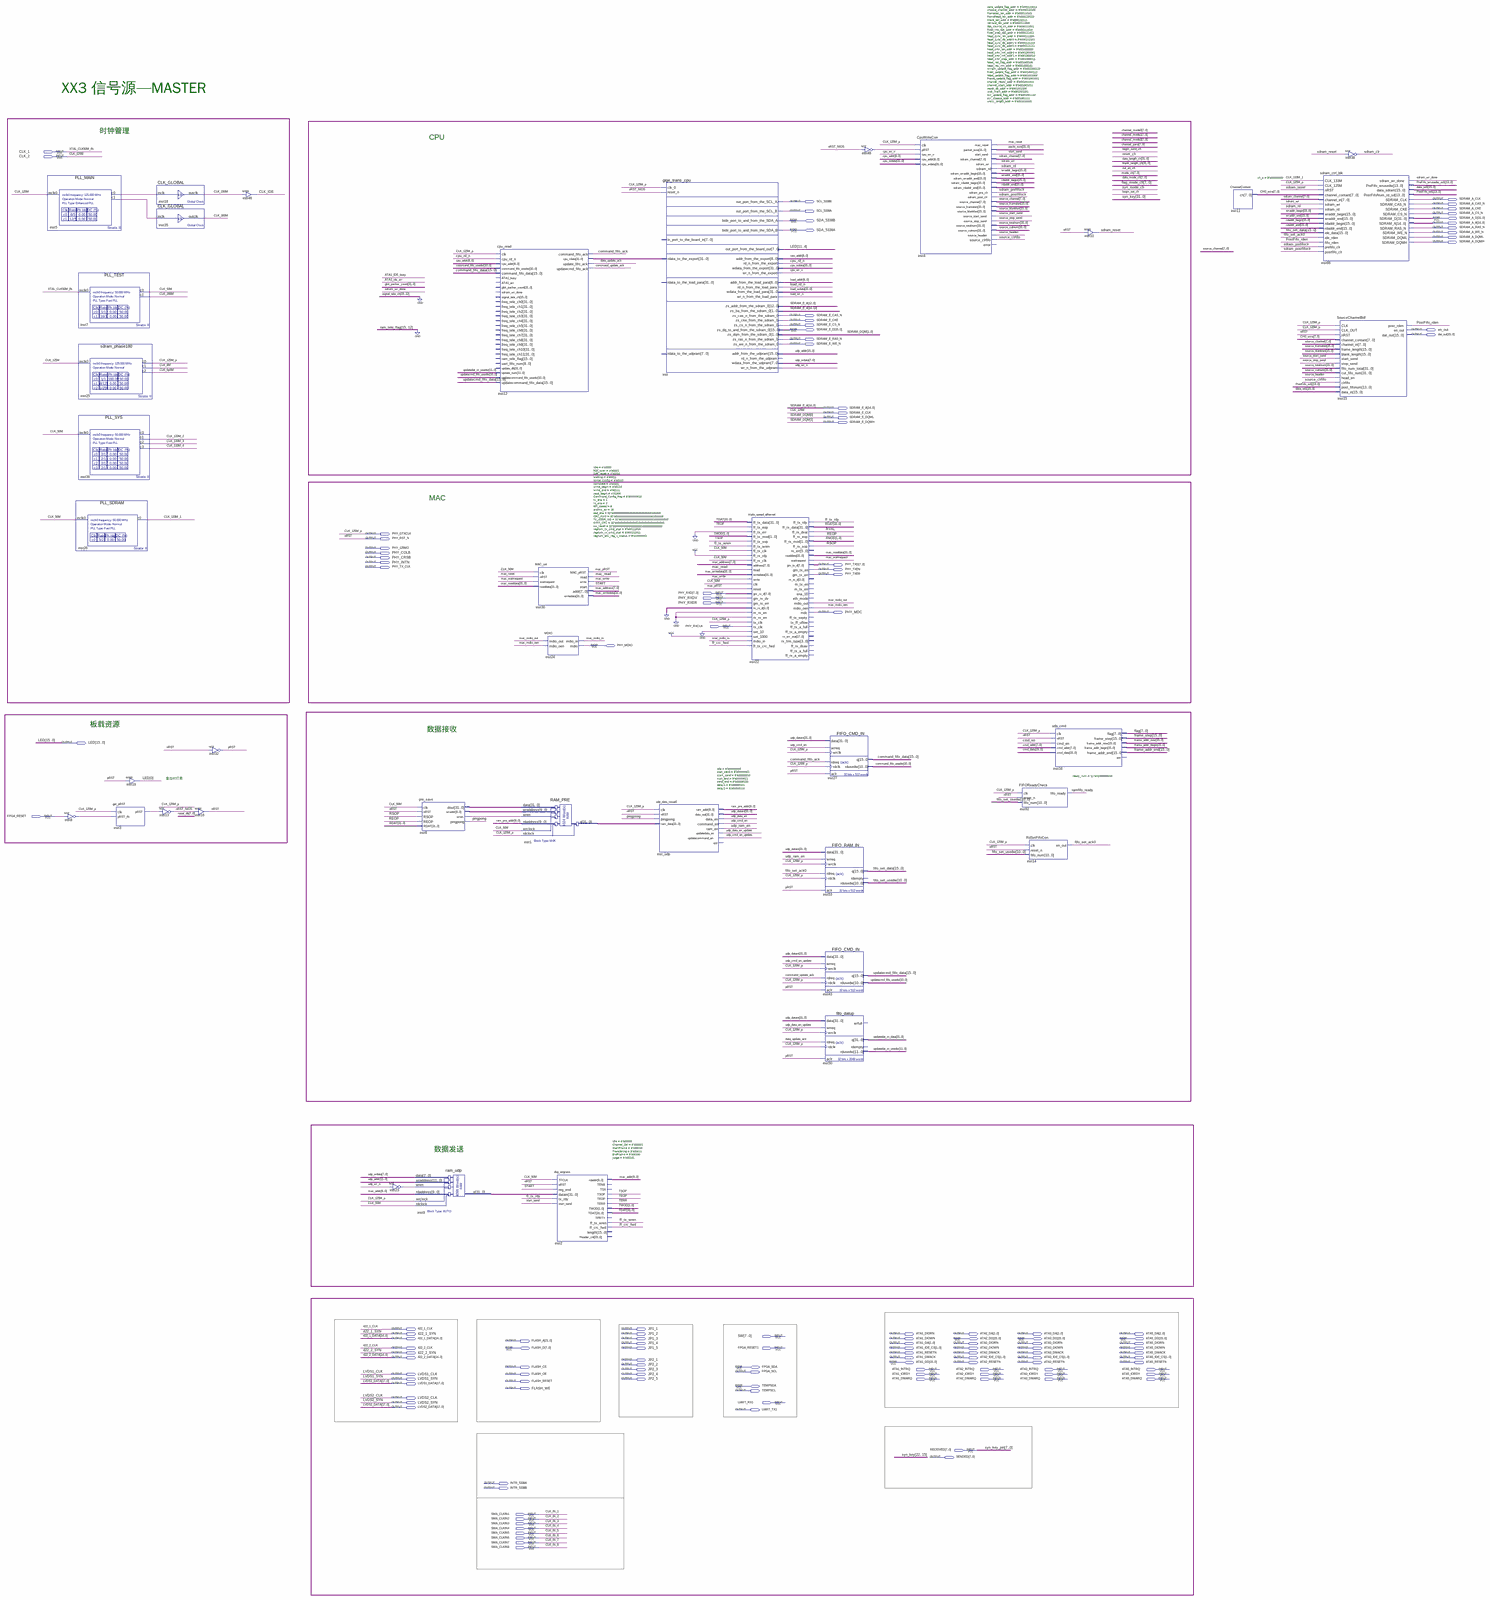
[diagram p0: schematic sheet, whole]
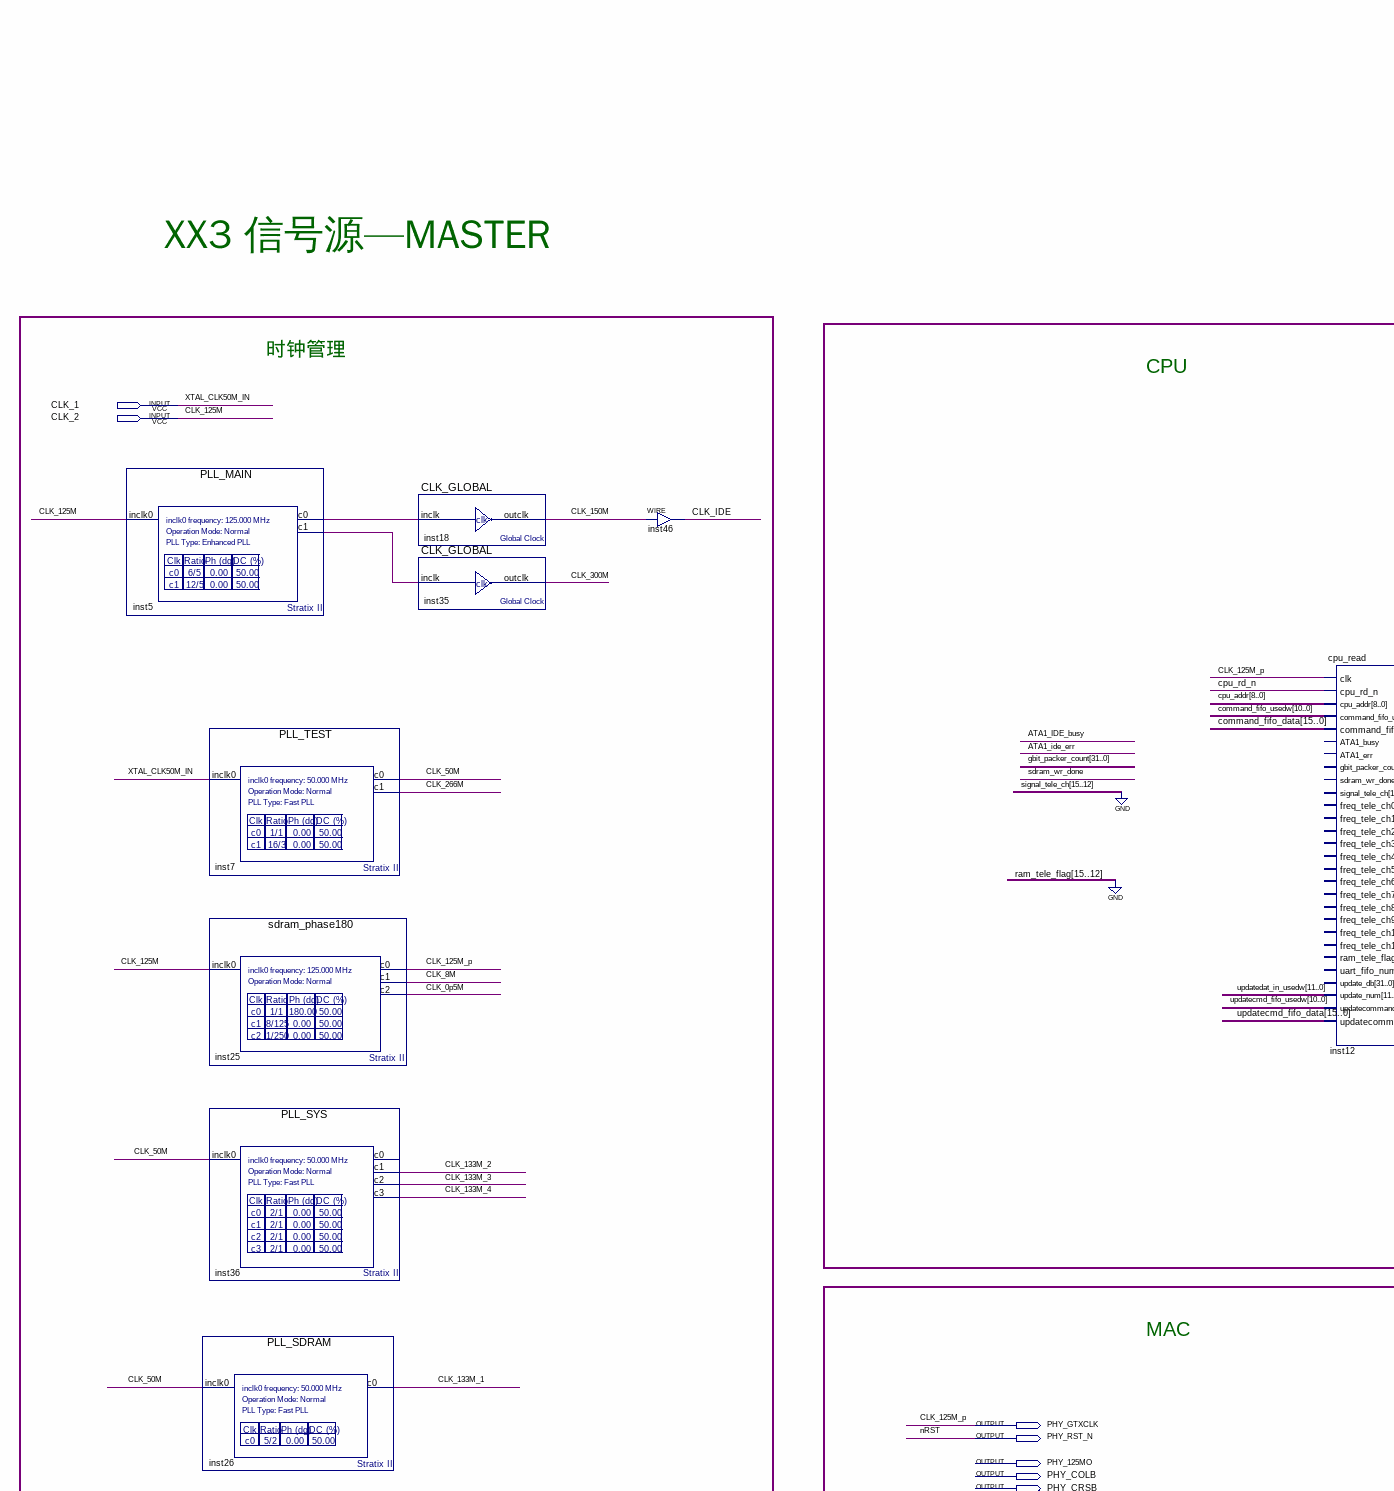
[diagram p1: schematic sheet, upper left part]
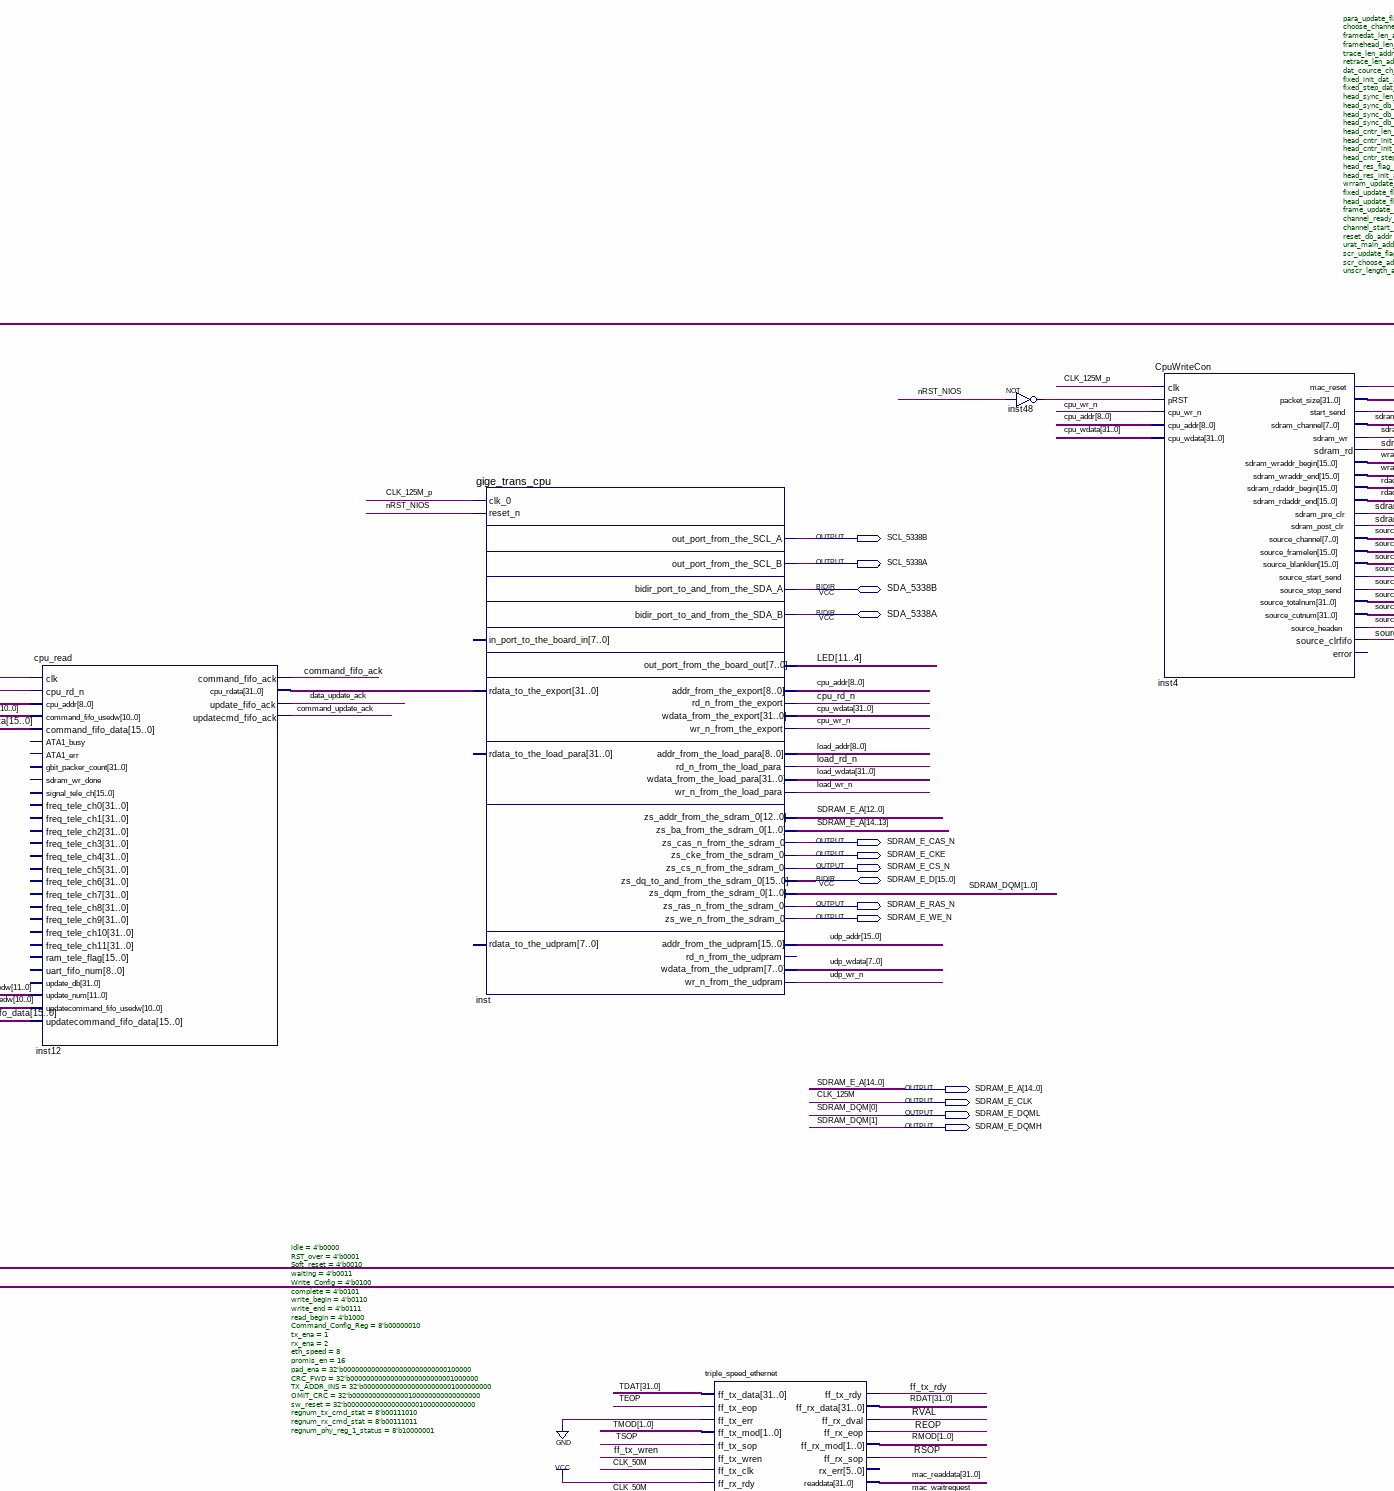
[diagram p2: schematic sheet, upper centre part]
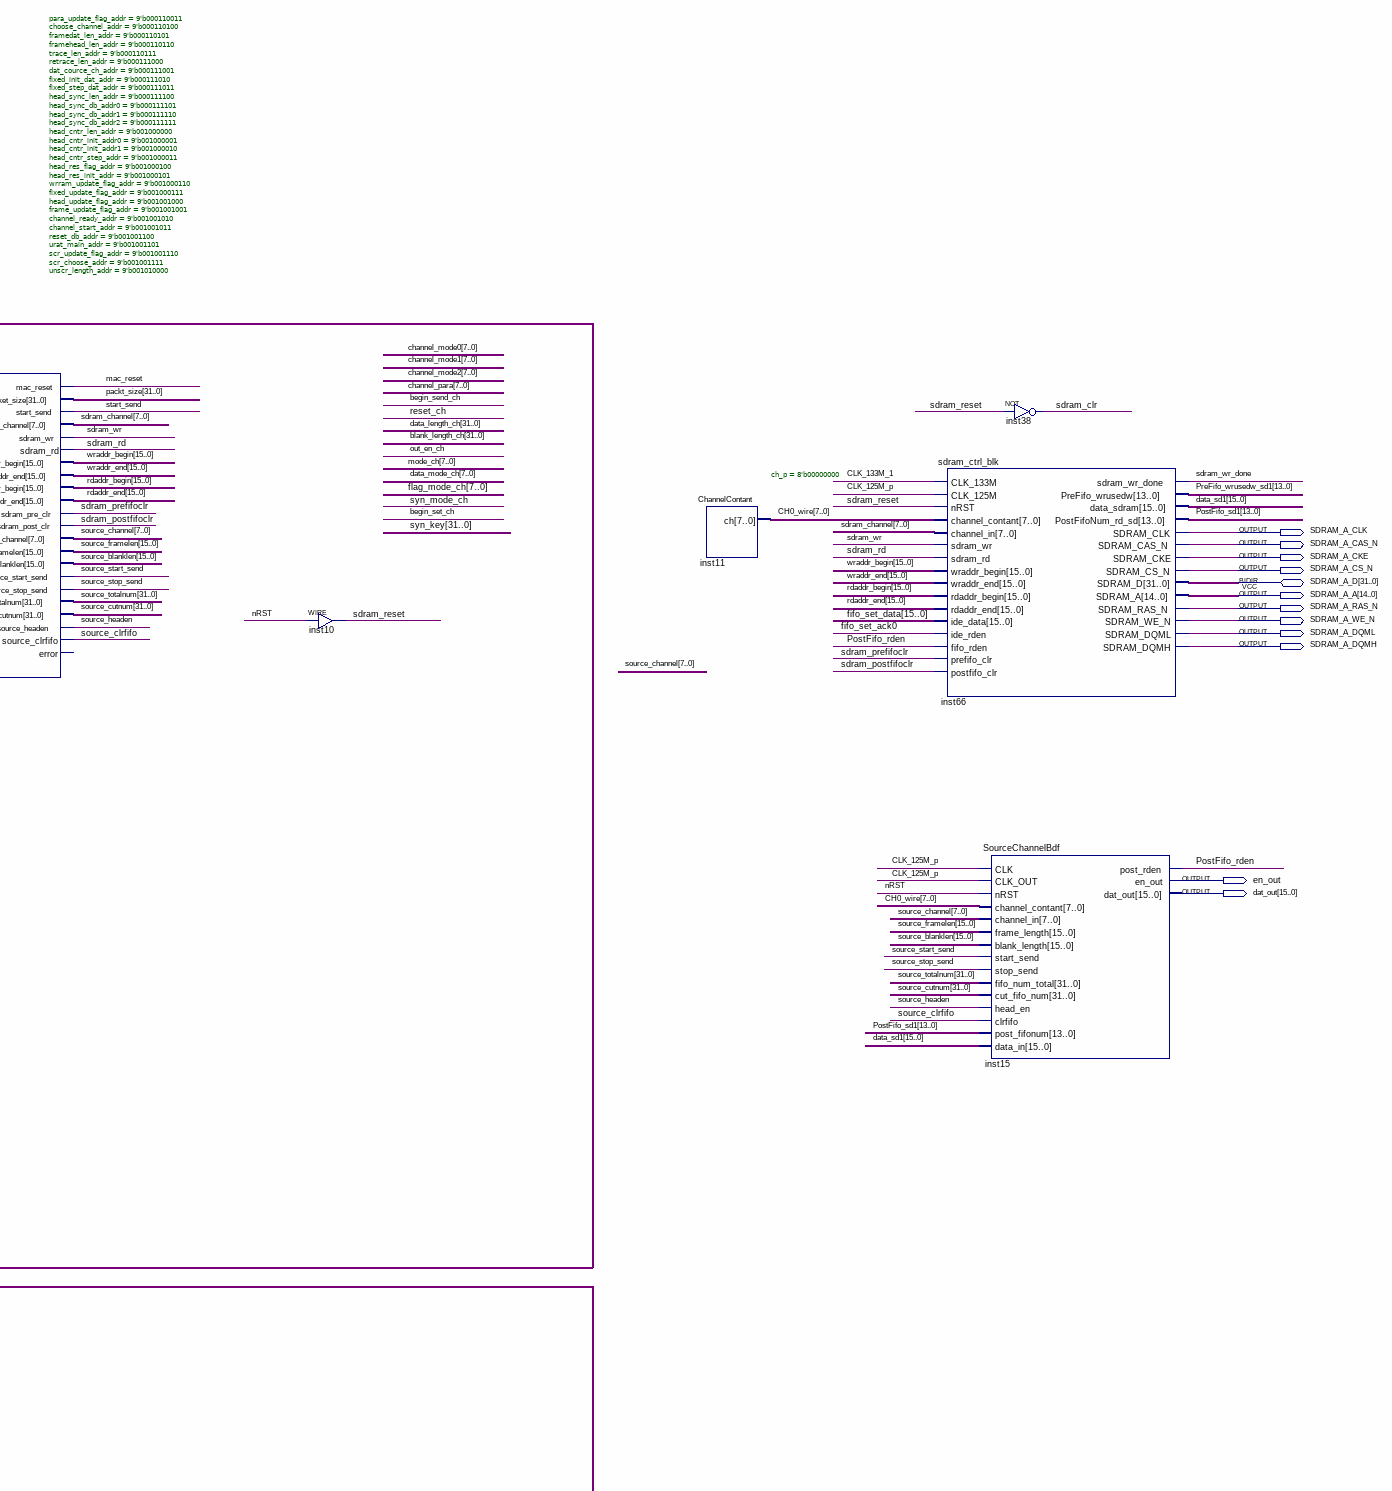
[diagram p3: schematic sheet, upper right part]
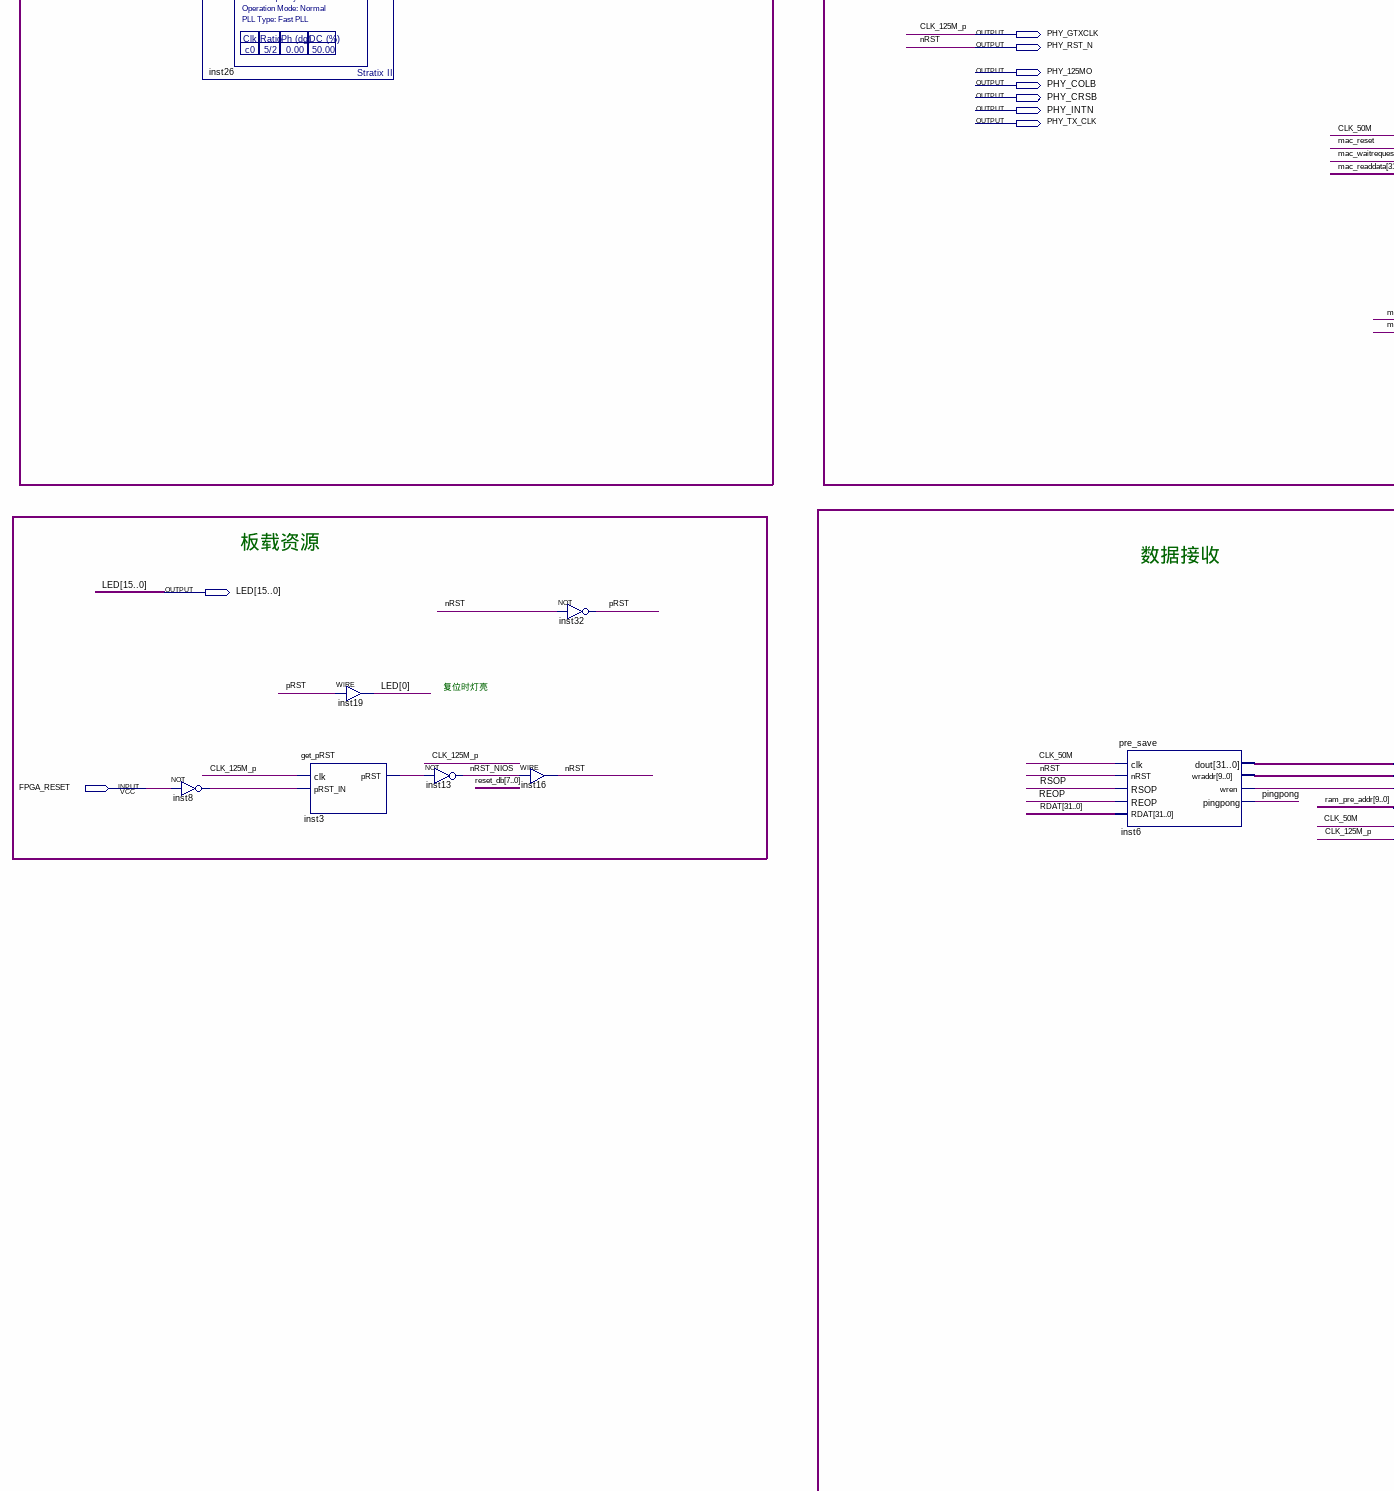
[diagram p4: schematic sheet, middle left part]
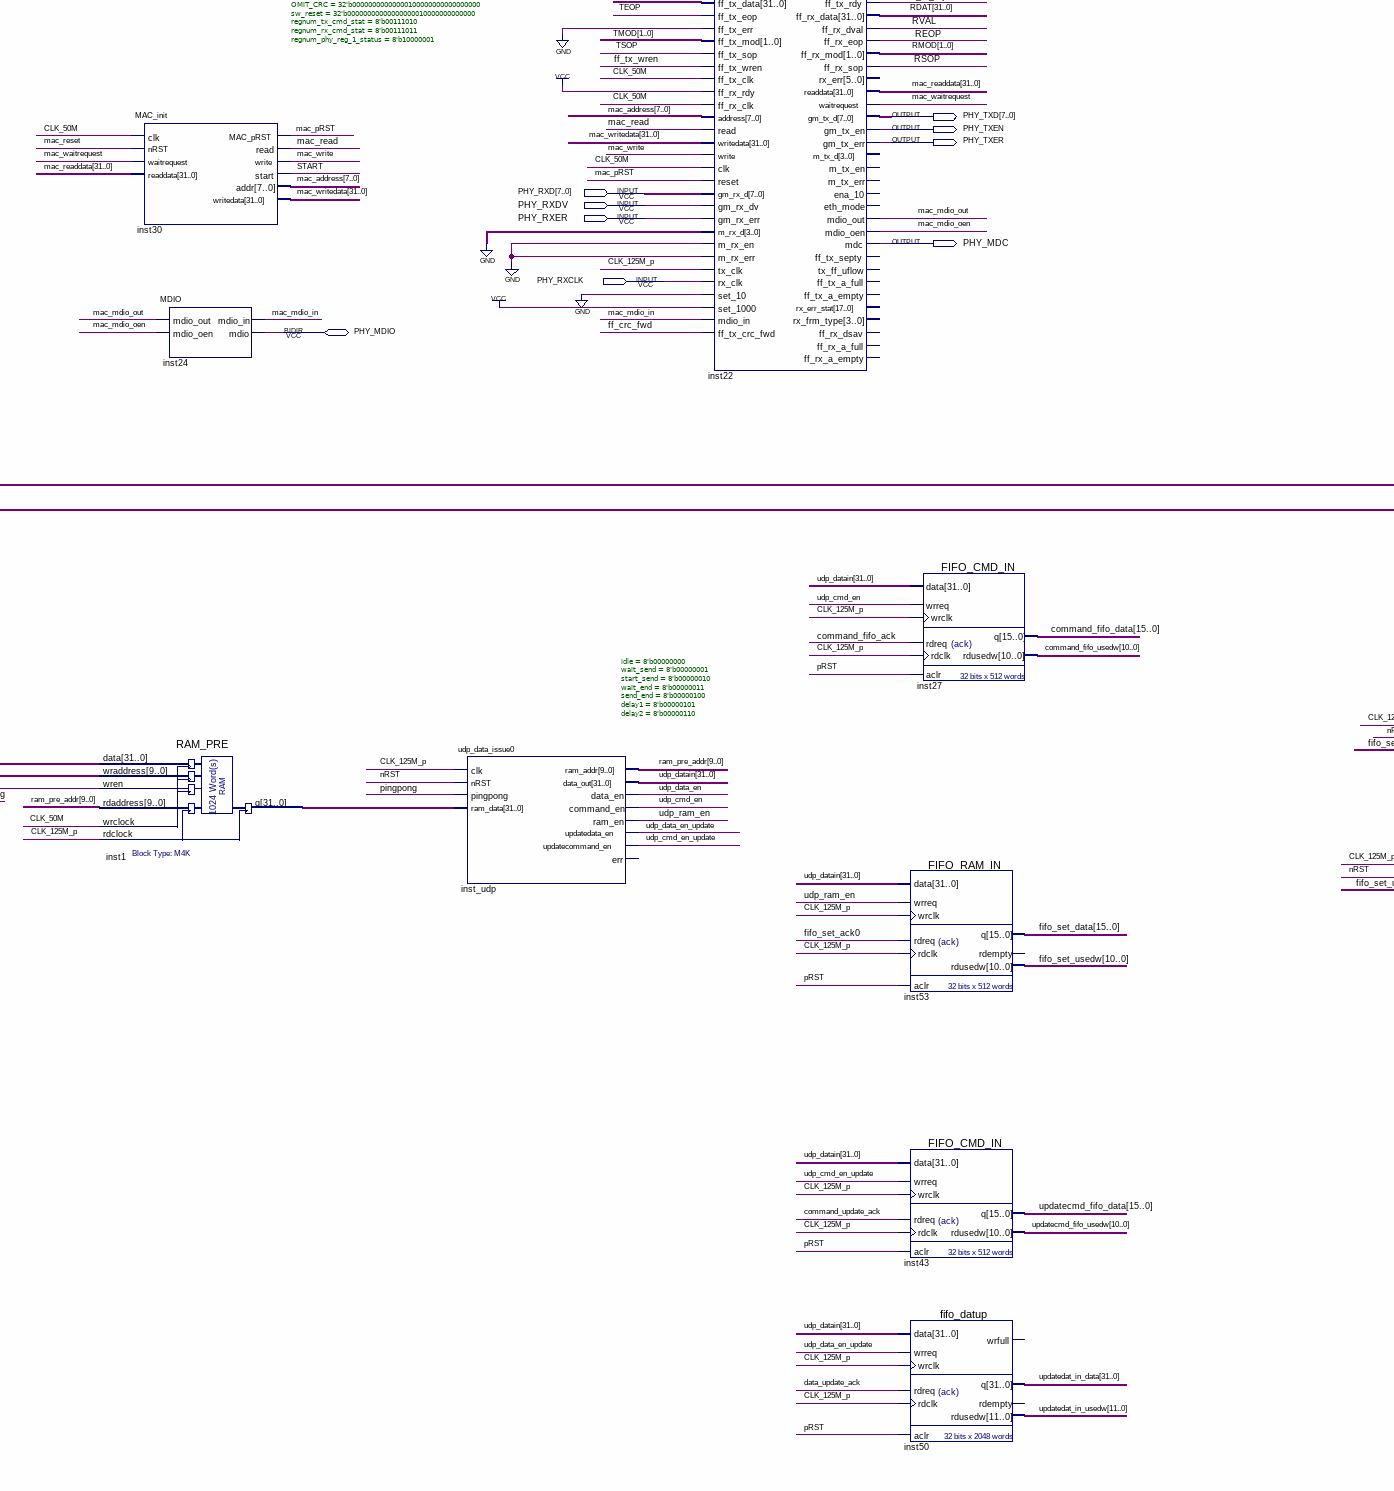
[diagram p5: schematic sheet, middle centre part]
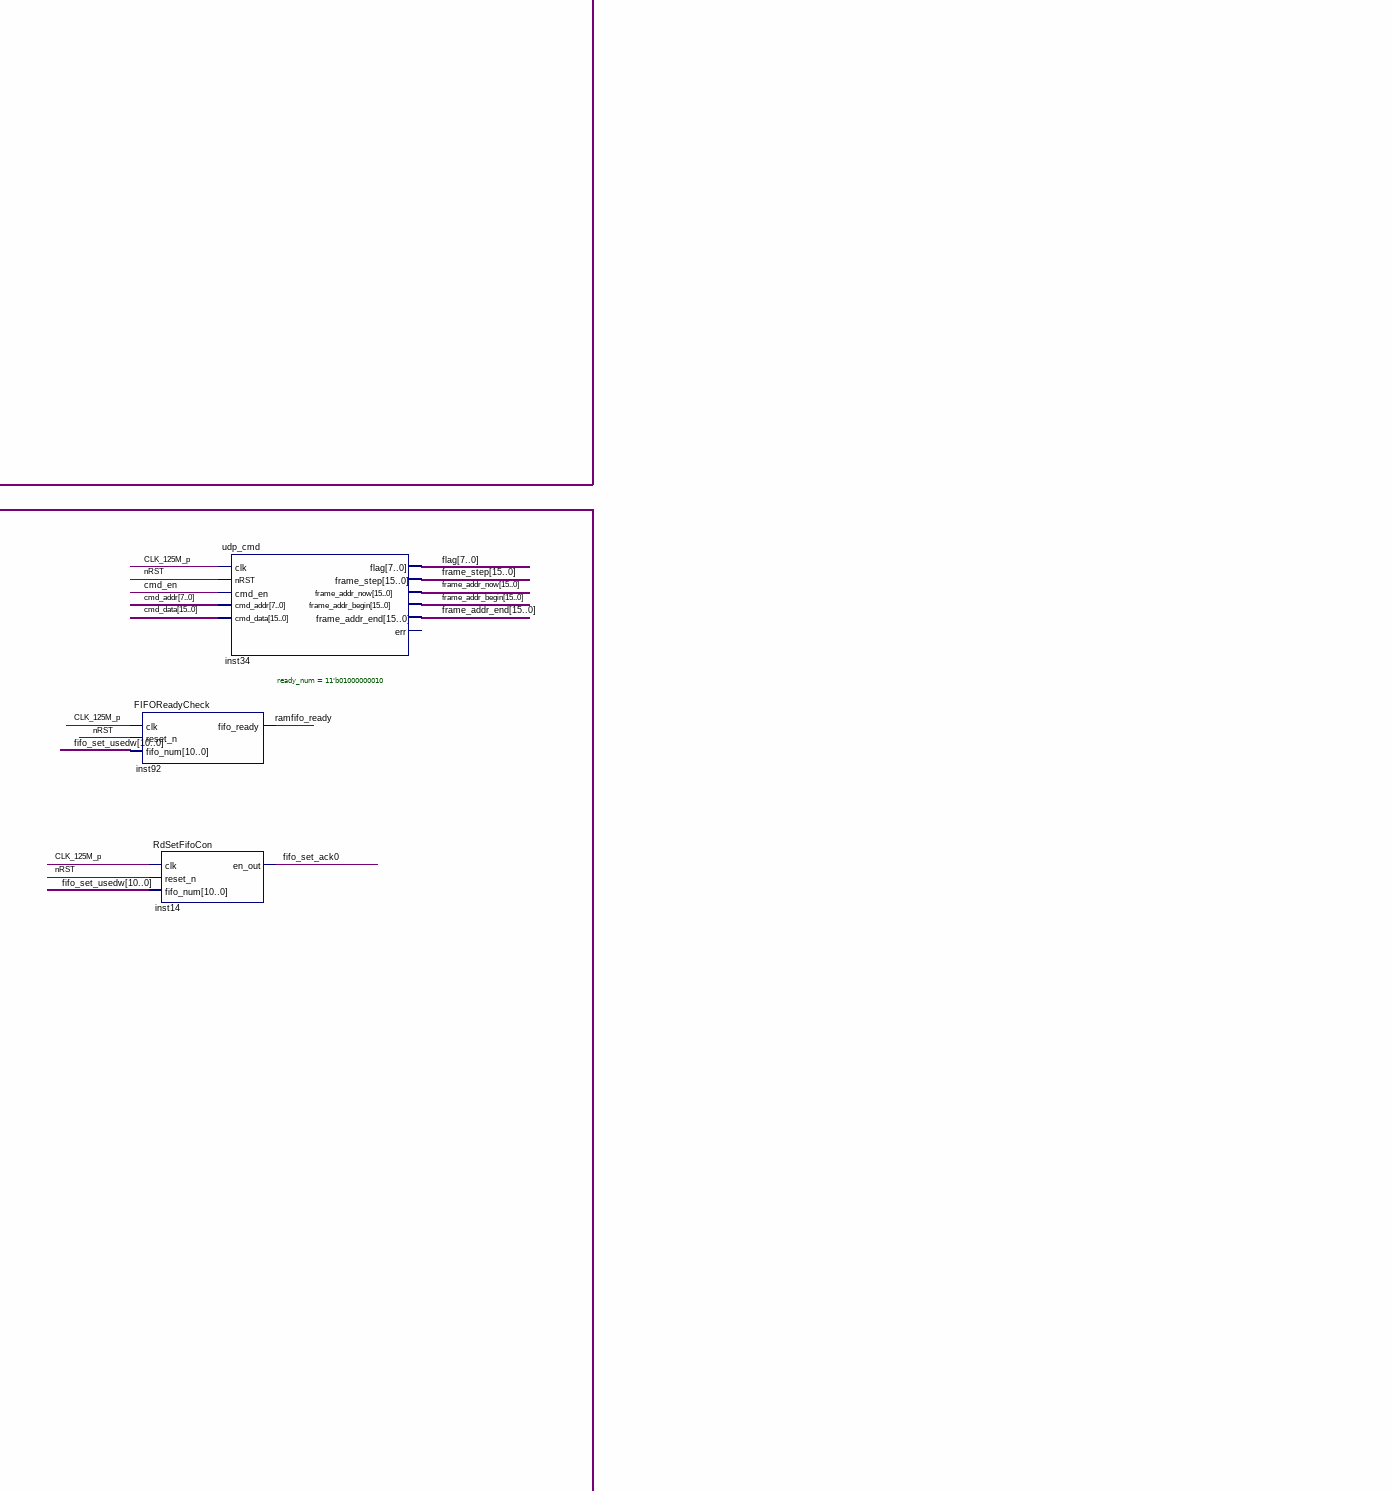
[diagram p6: schematic sheet, middle right part]
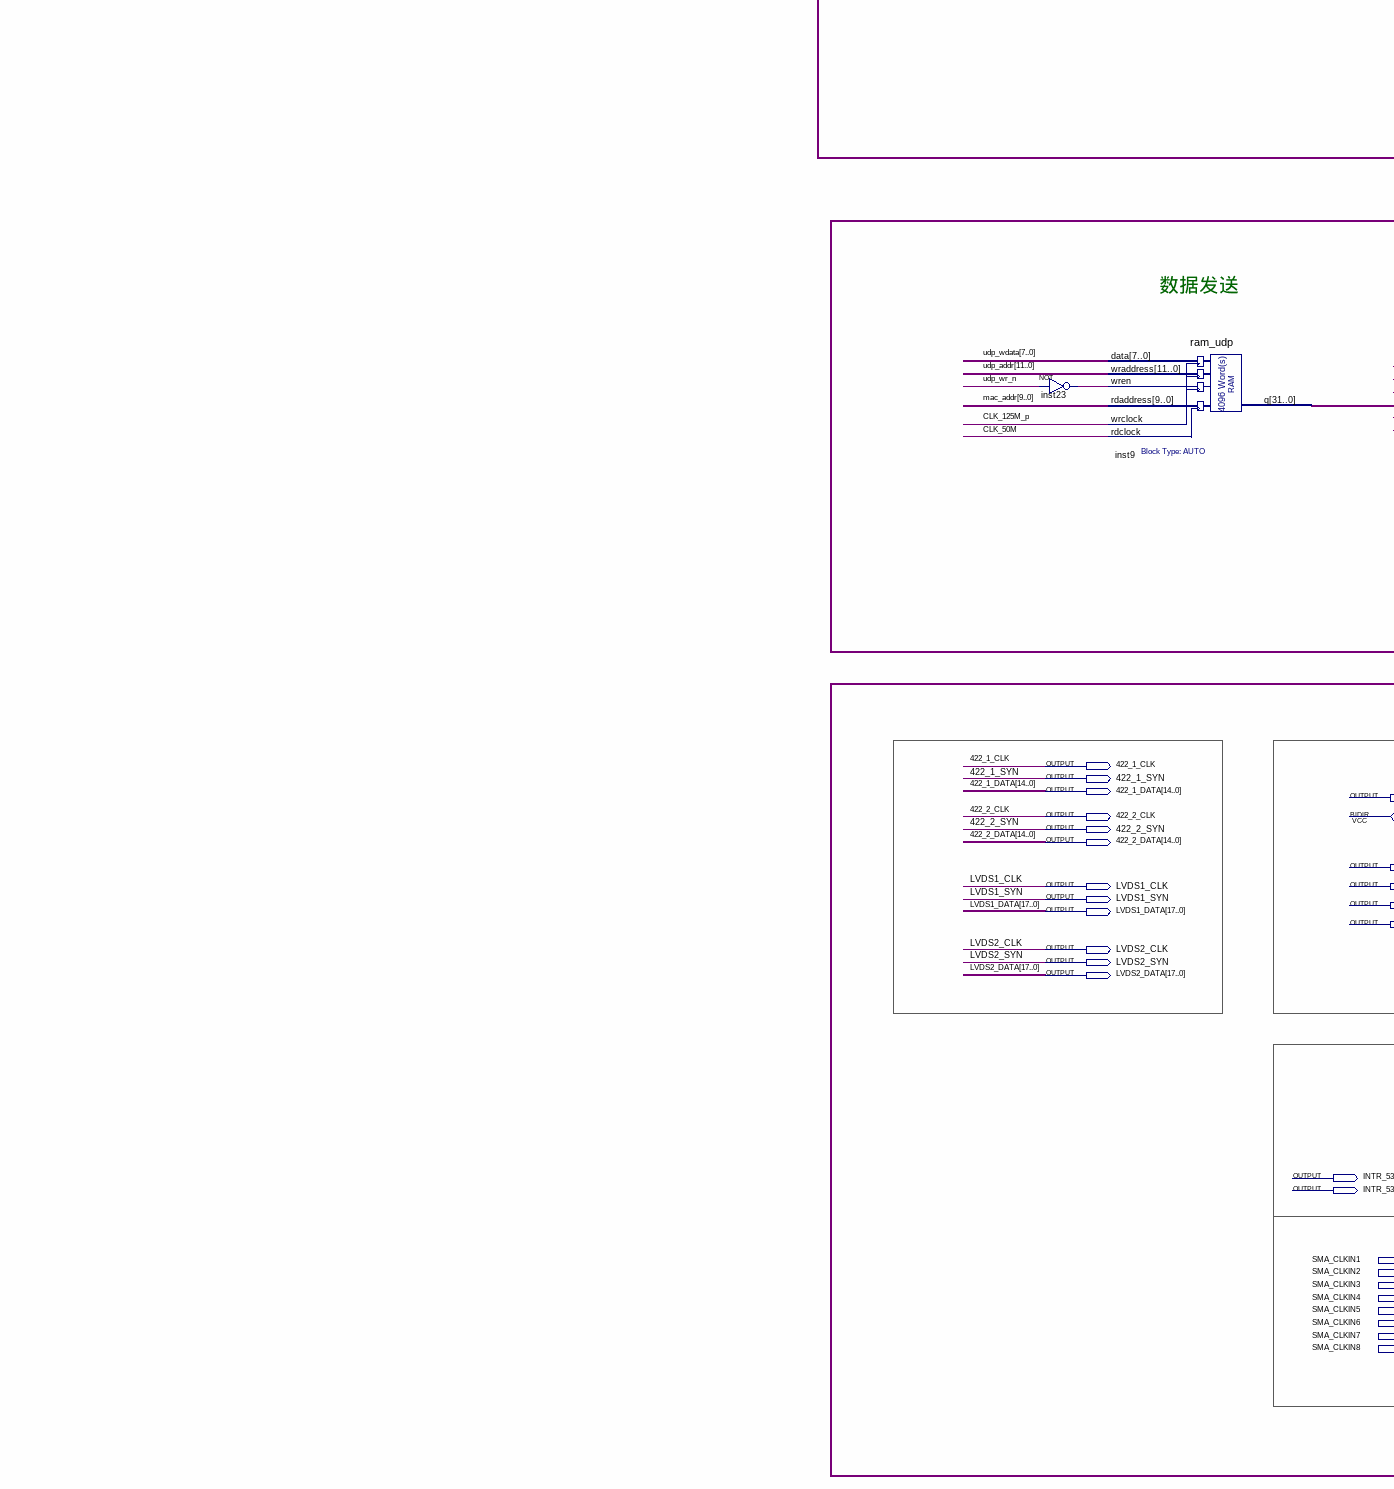
[diagram p7: schematic sheet, lower left part]
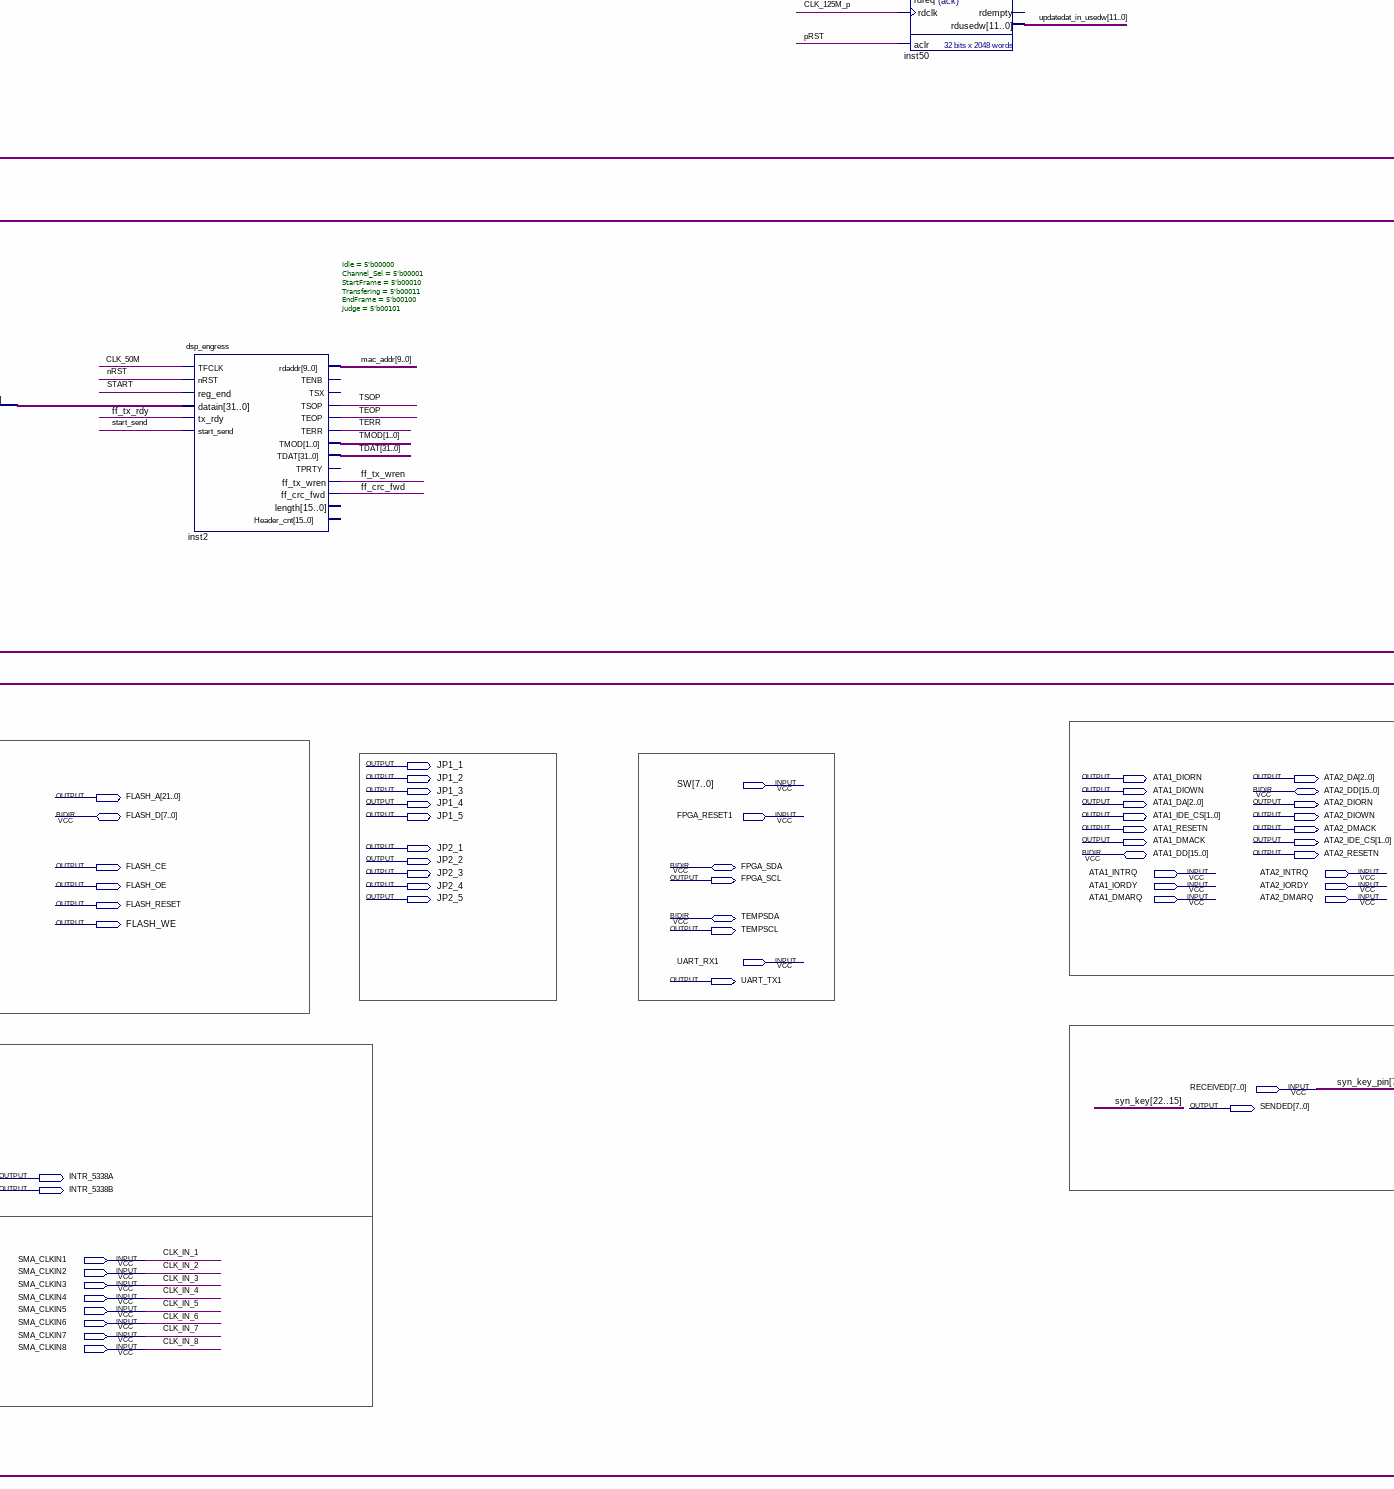
[diagram p8: schematic sheet, lower centre part]
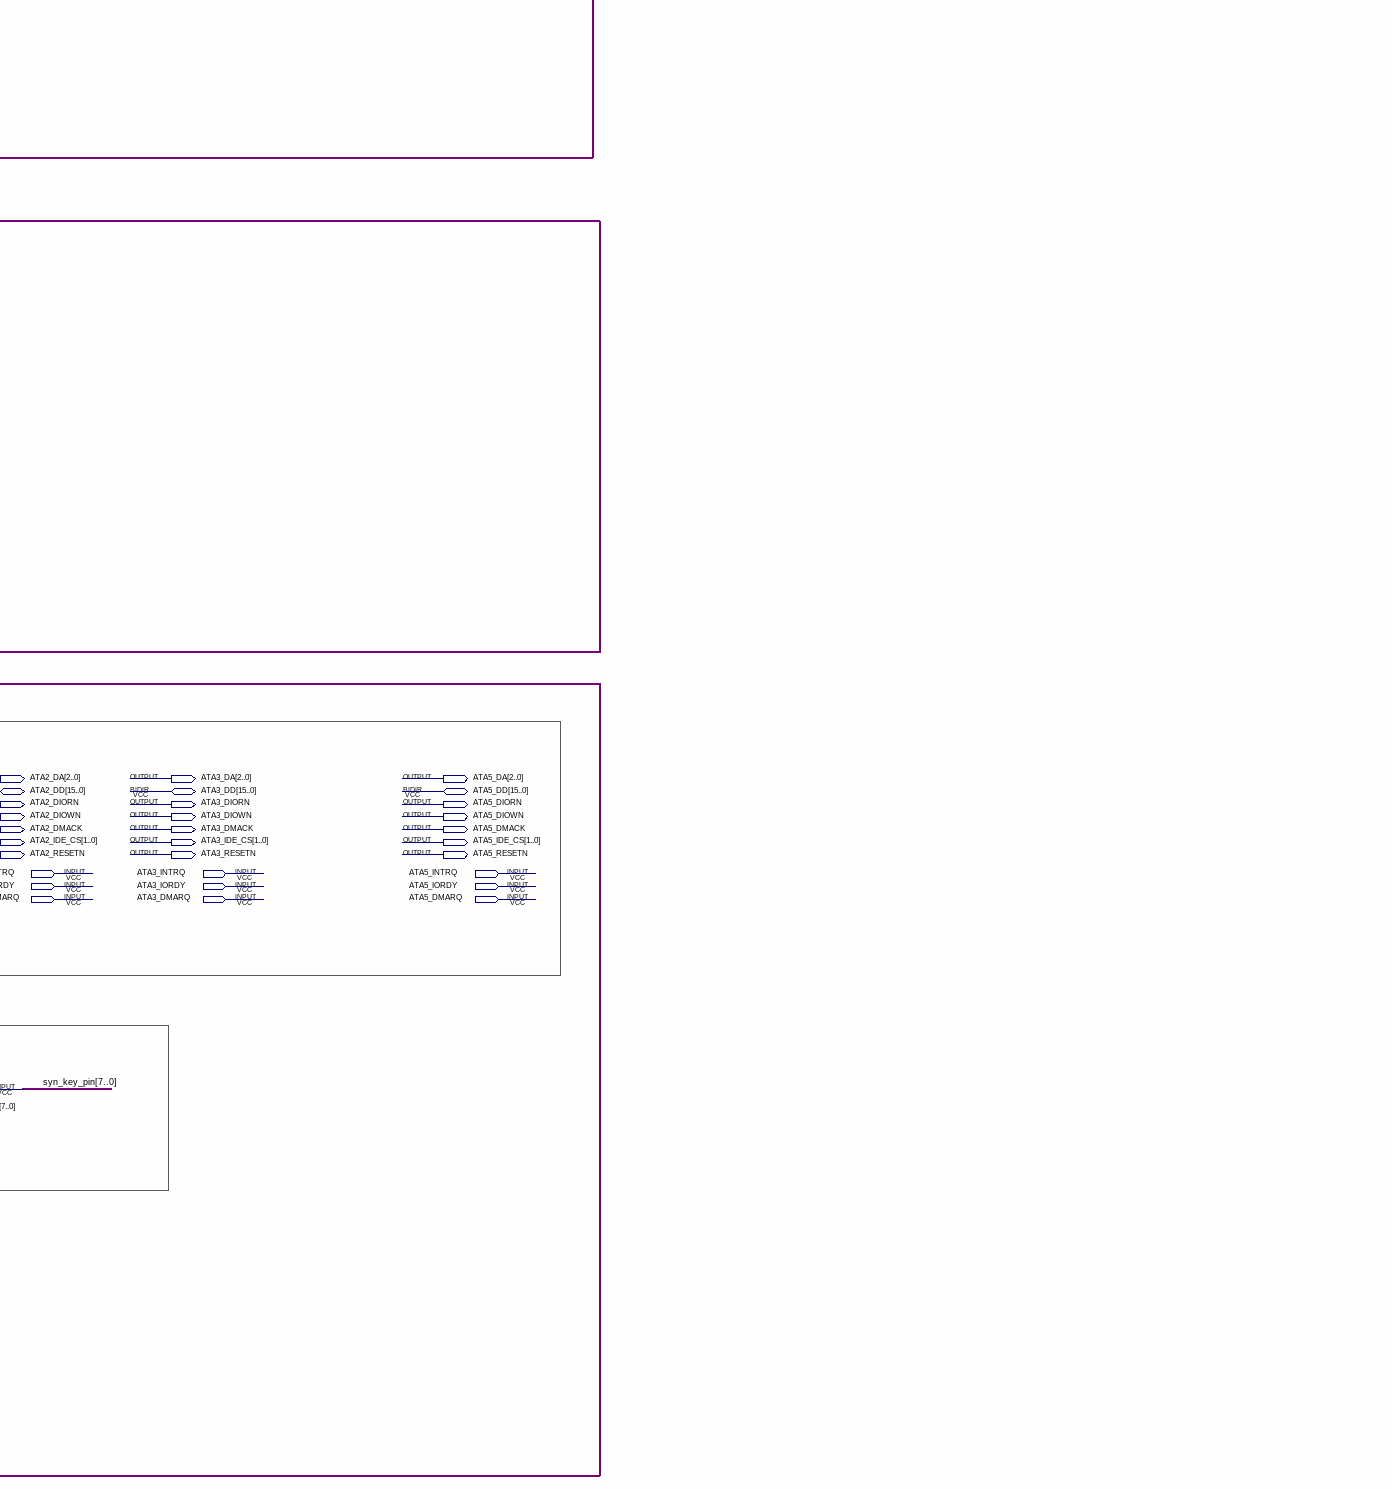
[diagram p9: schematic sheet, lower right part]
// Quartus schematic gige_transport_top.bdf as structural Verilog: 39 symbols, 134 pins
module gige_transport_top (
  input  CLK_1,
  input  CLK_2,
  input  [7:0] PHY_RXD,
  input  PHY_RXDV,
  input  PHY_RXER,
  input  PHY_RXCLK,
  input  FPGA_RESET,
  input  [7:0] SW,
  input  FPGA_RESET1,
  input  ATA1_INTRQ,
  input  ATA2_INTRQ,
  input  ATA3_INTRQ,
  input  ATA5_INTRQ,
  input  ATA1_IORDY,
  input  ATA2_IORDY,
  input  ATA3_IORDY,
  input  ATA5_IORDY,
  input  ATA1_DMARQ,
  input  ATA2_DMARQ,
  input  ATA3_DMARQ,
  input  ATA5_DMARQ,
  input  UART_RX1,
  input  [7:0] RECEIVED,
  input  SMA_CLKIN1,
  input  SMA_CLKIN2,
  input  SMA_CLKIN3,
  input  SMA_CLKIN4,
  input  SMA_CLKIN5,
  input  SMA_CLKIN6,
  input  SMA_CLKIN7,
  input  SMA_CLKIN8,
  inout  [31:0] SDRAM_A_D,
  inout  SDA_5338B,
  inout  SDA_5338A,
  inout  [15:0] SDRAM_E_D,
  inout  PHY_MDIO,
  inout  [15:0] ATA2_DD,
  inout  [15:0] ATA3_DD,
  inout  [15:0] ATA5_DD,
  inout  [7:0] FLASH_D,
  inout  [15:0] ATA1_DD,
  inout  FPGA_SDA,
  inout  TEMPSDA,
  output SDRAM_A_CLK,
  output SCL_5338B,
  output SDRAM_A_CAS_N,
  output SDRAM_A_CKE,
  output SCL_5338A,
  output SDRAM_A_CS_N,
  output [14:0] SDRAM_A_A,
  output SDRAM_A_RAS_N,
  output SDRAM_A_WE_N,
  output SDRAM_A_DQML,
  output SDRAM_A_DQMH,
  output SDRAM_E_CAS_N,
  output SDRAM_E_CKE,
  output SDRAM_E_CS_N,
  output en_out,
  output [15:0] dat_out,
  output SDRAM_E_RAS_N,
  output SDRAM_E_WE_N,
  output [14:0] SDRAM_E_A,
  output SDRAM_E_CLK,
  output SDRAM_E_DQML,
  output SDRAM_E_DQMH,
  output PHY_GTXCLK,
  output PHY_RST_N,
  output PHY_125MO,
  output PHY_COLB,
  output PHY_CRSB,
  output PHY_INTN,
  output [7:0] PHY_TXD,
  output PHY_TX_CLK,
  output PHY_TXEN,
  output PHY_TXER,
  output PHY_MDC,
  output [15:0] LED,
  output \422_1_CLK ,
  output JP1_1,
  output \422_1_SYN ,
  output JP1_2,
  output ATA1_DIORN,
  output [2:0] ATA2_DA,
  output [2:0] ATA3_DA,
  output [2:0] ATA5_DA,
  output [14:0] \422_1_DATA ,
  output JP1_3,
  output ATA1_DIOWN,
  output [21:0] FLASH_A,
  output JP1_4,
  output [2:0] ATA1_DA,
  output ATA2_DIORN,
  output ATA3_DIORN,
  output ATA5_DIORN,
  output \422_2_CLK ,
  output JP1_5,
  output [1:0] ATA1_IDE_CS,
  output ATA2_DIOWN,
  output ATA3_DIOWN,
  output ATA5_DIOWN,
  output \422_2_SYN ,
  output ATA1_RESETN,
  output ATA2_DMACK,
  output ATA3_DMACK,
  output ATA5_DMACK,
  output [14:0] \422_2_DATA ,
  output ATA1_DMACK,
  output [1:0] ATA2_IDE_CS,
  output [1:0] ATA3_IDE_CS,
  output [1:0] ATA5_IDE_CS,
  output JP2_1,
  output ATA2_RESETN,
  output ATA3_RESETN,
  output ATA5_RESETN,
  output JP2_2,
  output FLASH_CE,
  output JP2_3,
  output FPGA_SCL,
  output LVDS1_CLK,
  output FLASH_OE,
  output JP2_4,
  output LVDS1_SYN,
  output JP2_5,
  output FLASH_RESET,
  output [17:0] LVDS1_DATA,
  output FLASH_WE,
  output TEMPSCL,
  output LVDS2_CLK,
  output LVDS2_SYN,
  output [17:0] LVDS2_DATA,
  output UART_TX1,
  output [7:0] SENDED,
  output INTR_5338A,
  output INTR_5338B
);

  wire CLK_0p5M, CLK_8M, CLK_50M, CLK_133M_1, CLK_133M_2, CLK_133M_3, CLK_133M_4, CLK_150M, CLK_266M,
       CLK_300M, CLK_IDE, cmd_en, command_fifo_ack, command_update_ack, cpu_rd_n, cpu_wr_n, data_update_ack,
       ff_crc_fwd, ff_tx_rdy, ff_tx_wren, fifo_set_ack0, inst3_prst, inst5_c0, inst5_c1, inst6_wren,
       inst8_out, inst23_out, inst48_out, load_rd_n, load_wr_n, mac_mdio_in, mac_mdio_oen, mac_mdio_out,
       mac_pRST, mac_read, mac_reset, mac_waitrequest, mac_write, nRST_NIOS, pingpong, PostFifo_rden, pRST,
       ramfifo_ready, REOP, RSOP, RVAL, sdram_clr, sdram_postfifoclr, sdram_prefifoclr, sdram_rd,
       sdram_reset, sdram_wr, sdram_wr_done, source_clrfifo, source_headen, source_start_send,
       source_stop_send, START, start_send, TEOP, TERR, TSOP, udp_cmd_en, udp_cmd_en_update, udp_data_en,
       udp_data_en_update, udp_ram_en, udp_wr_n;
  wire [1:0] RMOD, TMOD;
  wire [7:0] CH0_wire, cmd_addr, flag, mac_address, sdram_channel, source_channel, udp_wdata;
  wire [8:0] cpu_addr, load_addr;
  wire [9:0] inst6_wraddr, mac_addr, ram_pre_addr;
  wire [10:0] command_fifo_usedw, fifo_set_usedw, updatecmd_fifo_usedw;
  wire [11:0] updatedat_in_usedw;
  wire [13:0] PostFifo_sd1, PreFifo_wrusedw_sd1;
  wire [15:0] cmd_data, command_fifo_data, data_sd1, fifo_set_data, frame_addr_begin, frame_addr_end,
       frame_addr_now, frame_step, rdaddr_begin, rdaddr_end, source_blanklen, source_framelen, udp_addr,
       updatecmd_fifo_data, wraddr_begin, wraddr_end;
  wire [31:0] cpu_wdata, inst1_q, inst6_dout, inst9_q, inst12_cpu_rdata, load_wdata, mac_readdata,
       mac_writedata, packt_size, RDAT, source_cutnum, source_totalnum, TDAT, udp_datain, updatedat_in_data;

  PLL_MAIN inst5 (.inclk0(CLK_2), .c0(inst5_c0), .c1(inst5_c1));
  not inst8 (inst8_out, FPGA_RESET);
  PLL_TEST inst7 (.inclk0(CLK_1), .c0(CLK_50M), .c1(CLK_266M));
  sdram_phase180 inst25 (.inclk0(CLK_2), .c0(PHY_GTXCLK), .c1(CLK_8M), .c2(CLK_0p5M));
  PLL_SYS inst36 (.inclk0(CLK_50M), .c1(CLK_133M_2), .c2(CLK_133M_3), .c3(CLK_133M_4));  // open: c0
  PLL_SDRAM inst26 (.inclk0(CLK_50M), .c0(CLK_133M_1));
  get_pRST inst3 (.clk(PHY_GTXCLK), .pRST_IN(inst8_out), .pRST(inst3_prst));
  assign LED[0] = pRST;  // WIRE inst19
  CLK_GLOBAL inst18 (.inclk(inst5_c0), .outclk(CLK_150M));
  CLK_GLOBAL inst35 (.inclk(inst5_c1), .outclk(CLK_300M));
  not inst13 (nRST_NIOS, inst3_prst);
  assign PHY_RST_N = nRST_NIOS;  // WIRE inst16
  not inst32 (pRST, PHY_RST_N);
  assign CLK_IDE = CLK_150M;  // WIRE inst46
  not inst23 (inst23_out, udp_wr_n);
  pre_save inst6 (
    .clk(CLK_50M), .nRST(PHY_RST_N), .RSOP(RSOP), .REOP(REOP), .RDAT(RDAT), .dout(inst6_dout),
    .wraddr(inst6_wraddr), .wren(inst6_wren), .pingpong(pingpong));
  ram_udp inst9 (
    .data(udp_wdata), .wraddress(udp_addr[11:0]), .wren(inst23_out), .rdaddress(mac_addr),
    .wrclock(PHY_GTXCLK), .rdclock(CLK_50M), .q(inst9_q));
  cpu_read inst12 (
    .clk(PHY_GTXCLK), .cpu_rd_n(cpu_rd_n), .cpu_addr(cpu_addr), .command_fifo_usedw(command_fifo_usedw),
    .command_fifo_data(command_fifo_data), .update_num(updatedat_in_usedw),
    .updatecommand_fifo_usedw(updatecmd_fifo_usedw), .updatecommand_fifo_data(updatecmd_fifo_data),
    .command_fifo_ack(command_fifo_ack), .cpu_rdata(inst12_cpu_rdata), .update_fifo_ack(data_update_ack),
    .updatecmd_fifo_ack(command_update_ack));  // open: ATA1_busy, ATA1_err, gbit_packer_count, sdram_wr_done, signal_tele_ch, freq_tele_ch0, freq_tele_ch1, freq_tele_ch2, freq_tele_ch3, freq_tele_ch4, freq_tele_ch5, freq_tele_ch6, freq_tele_ch7, freq_tele_ch8, freq_tele_ch9, freq_tele_ch10, freq_tele_ch11, ram_tele_flag, uart_fifo_num, update_db
  RAM_PRE inst1 (
    .data(inst6_dout), .wraddress(inst6_wraddr), .wren(inst6_wren), .rdaddress(ram_pre_addr),
    .wrclock(CLK_50M), .rdclock(PHY_GTXCLK), .q(inst1_q));
  MAC_init #(.idle(4'b0000), .RST_over(4'b0001), .Soft_reset(4'b0010), .waiting(4'b0011), .Write_Config(4'b0100), .complete(4'b0101), .write_begin(4'b0110), .write_end(4'b0111), .read_begin(4'b1000), .Command_Config_Reg(8'b00000010), .tx_ena(1), .rx_ena(2), .eth_speed(8), .promis_en(16), .pad_ena(32'b00000000000000000000000000100000), .CRC_FWD(32'b00000000000000000000000001000000), .TX_ADDR_INS(32'b00000000000000000000001000000000), .OMIT_CRC(32'b00000000000000100000000000000000), .sw_reset(32'b00000000000000000010000000000000), .regnum_tx_cmd_stat(8'b00111010), .regnum_rx_cmd_stat(8'b00111011), .regnum_phy_reg_1_status(8'b10000001)) inst30 (
    .clk(CLK_50M), .nRST(mac_reset), .waitrequest(mac_waitrequest), .readdata(mac_readdata),
    .MAC_pRST(mac_pRST), .read(mac_read), .write(mac_write), .start(START), .addr(mac_address),
    .writedata(mac_writedata));
  MDIO inst24 (.mdio_out(mac_mdio_out), .mdio_oen(mac_mdio_oen), .mdio_in(mac_mdio_in), .mdio(PHY_MDIO));
  dsp_engress #(.Idle(5'b00000), .Channel_Sel(5'b00001), .StartFrame(5'b00010), .Transfering(5'b00011), .EndFrame(5'b00100), .Judge(5'b00101)) inst2 (
    .TFCLK(CLK_50M), .nRST(PHY_RST_N), .reg_end(START), .datain(inst9_q), .tx_rdy(ff_tx_rdy),
    .start_send(start_send), .rdaddr(mac_addr), .TSOP(TSOP), .TEOP(TEOP), .TERR(TERR), .TMOD(TMOD),
    .TDAT(TDAT), .ff_tx_wren(ff_tx_wren), .ff_crc_fwd(ff_crc_fwd));  // open: TENB, TSX, TPRTY, length, Header_cnt
  udp_data_issue0 #(.idle(8'b00000000), .wait_send(8'b00000001), .start_send(8'b00000010), .wait_end(8'b00000011), .send_end(8'b00000100), .delay1(8'b00000101), .delay2(8'b00000110)) inst_udp (
    .clk(PHY_GTXCLK), .nRST(PHY_RST_N), .pingpong(pingpong), .ram_data(inst1_q), .ram_addr(ram_pre_addr),
    .data_out(udp_datain), .data_en(udp_data_en), .command_en(udp_cmd_en), .ram_en(udp_ram_en),
    .updatedata_en(udp_data_en_update), .updatecommand_en(udp_cmd_en_update));  // open: err
  gige_trans_cpu inst (
    .clk_0(PHY_GTXCLK), .reset_n(nRST_NIOS), .rdata_to_the_export(inst12_cpu_rdata),
    .out_port_from_the_SCL_A(SCL_5338B), .out_port_from_the_SCL_B(SCL_5338A),
    .out_port_from_the_board_out(LED[11:4]), .addr_from_the_export(cpu_addr),
    .rd_n_from_the_export(cpu_rd_n), .wdata_from_the_export(cpu_wdata), .wr_n_from_the_export(cpu_wr_n),
    .addr_from_the_load_para(load_addr), .rd_n_from_the_load_para(load_rd_n),
    .wdata_from_the_load_para(load_wdata), .wr_n_from_the_load_para(load_wr_n),
    .zs_addr_from_the_sdram_0(SDRAM_E_A[12:0]), .zs_ba_from_the_sdram_0(SDRAM_E_A[14:13]),
    .zs_cas_n_from_the_sdram_0(SDRAM_E_CAS_N), .zs_cke_from_the_sdram_0(SDRAM_E_CKE),
    .zs_cs_n_from_the_sdram_0(SDRAM_E_CS_N), .zs_dqm_from_the_sdram_0({SDRAM_E_DQMH, SDRAM_E_DQML}),
    .zs_ras_n_from_the_sdram_0(SDRAM_E_RAS_N), .zs_we_n_from_the_sdram_0(SDRAM_E_WE_N),
    .addr_from_the_udpram(udp_addr), .wdata_from_the_udpram(udp_wdata), .wr_n_from_the_udpram(udp_wr_n),
    .bidir_port_to_and_from_the_SDA_A(SDA_5338B), .bidir_port_to_and_from_the_SDA_B(SDA_5338A),
    .zs_dq_to_and_from_the_sdram_0(SDRAM_E_D));  // open: in_port_to_the_board_in, rdata_to_the_load_para, rdata_to_the_udpram, rd_n_from_the_udpram
  triple_speed_ethernet inst22 (
    .ff_tx_data(TDAT), .ff_tx_eop(TEOP), .ff_tx_err(1'b0), .ff_tx_mod(TMOD), .ff_tx_sop(TSOP),
    .ff_tx_wren(ff_tx_wren), .ff_tx_clk(CLK_50M), .ff_rx_rdy(1'b1), .ff_rx_clk(CLK_50M),
    .address(mac_address), .read(mac_read), .writedata(mac_writedata), .write(mac_write), .clk(CLK_50M),
    .reset(mac_pRST), .gm_rx_d(PHY_RXD), .gm_rx_dv(PHY_RXDV), .gm_rx_err(PHY_RXER), .m_rx_d(4'b0000),
    .m_rx_en(1'b0), .m_rx_err(1'b0), .tx_clk(PHY_GTXCLK), .rx_clk(PHY_RXCLK), .set_10(1'b0), .set_1000(1'b1),
    .mdio_in(mac_mdio_in), .ff_tx_crc_fwd(ff_crc_fwd), .ff_tx_rdy(ff_tx_rdy), .ff_rx_data(RDAT),
    .ff_rx_dval(RVAL), .ff_rx_eop(REOP), .ff_rx_mod(RMOD), .ff_rx_sop(RSOP), .readdata(mac_readdata),
    .waitrequest(mac_waitrequest), .gm_tx_d(PHY_TXD), .gm_tx_en(PHY_TXEN), .gm_tx_err(PHY_TXER),
    .mdio_out(mac_mdio_out), .mdio_oen(mac_mdio_oen), .mdc(PHY_MDC));  // open: rx_err, m_tx_d, m_tx_en, m_tx_err, ena_10, eth_mode, ff_tx_septy, tx_ff_uflow, ff_tx_a_full, ff_tx_a_empty, rx_err_stat, rx_frm_type, ff_rx_dsav, ff_rx_a_full, ff_rx_a_empty
  FIFO_CMD_IN inst27 (
    .data(udp_datain), .wrreq(udp_cmd_en), .wrclk(PHY_GTXCLK), .rdreq(command_fifo_ack), .rdclk(PHY_GTXCLK),
    .aclr(pRST), .q(command_fifo_data), .rdusedw(command_fifo_usedw));
  FIFO_RAM_IN inst53 (
    .data(udp_datain), .wrreq(udp_ram_en), .wrclk(PHY_GTXCLK), .rdreq(fifo_set_ack0), .rdclk(PHY_GTXCLK),
    .aclr(pRST), .q(fifo_set_data), .rdusedw(fifo_set_usedw));  // open: rdempty
  FIFO_CMD_IN inst43 (
    .data(udp_datain), .wrreq(udp_cmd_en_update), .wrclk(PHY_GTXCLK), .rdreq(command_update_ack),
    .rdclk(PHY_GTXCLK), .aclr(pRST), .q(updatecmd_fifo_data), .rdusedw(updatecmd_fifo_usedw));
  fifo_datup inst50 (
    .data(udp_datain), .wrreq(udp_data_en_update), .wrclk(PHY_GTXCLK), .rdreq(data_update_ack),
    .rdclk(PHY_GTXCLK), .aclr(pRST), .q(updatedat_in_data), .rdusedw(updatedat_in_usedw));  // open: wrfull, rdempty
  not inst48 (inst48_out, nRST_NIOS);
  CpuWriteCon #(.para_update_flag_addr(9'b000110011), .choose_channel_addr(9'b000110100), .framedat_len_addr(9'b000110101), .framehead_len_addr(9'b000110110), .trace_len_addr(9'b000110111), .retrace_len_addr(9'b000111000), .dat_cource_ch_addr(9'b000111001), .fixed_init_dat_addr(9'b000111010), .fixed_step_dat_addr(9'b000111011), .head_sync_len_addr(9'b000111100), .head_sync_db_addr0(9'b000111101), .head_sync_db_addr1(9'b000111110), .head_sync_db_addr2(9'b000111111), .head_cntr_len_addr(9'b001000000), .head_cntr_init_addr0(9'b001000001), .head_cntr_init_addr1(9'b001000010), .head_cntr_step_addr(9'b001000011), .head_res_flag_addr(9'b001000100), .head_res_init_addr(9'b001000101), .wrram_update_flag_addr(9'b001000110), .fixed_update_flag_addr(9'b001000111), .head_update_flag_addr(9'b001001000), .frame_update_flag_addr(9'b001001001), .channel_ready_addr(9'b001001010), .channel_start_addr(9'b001001011), .reset_db_addr(9'b001001100), .urat_main_addr(9'b001001101), .scr_update_flag_addr(9'b001001110), .scr_choose_addr(9'b001001111), .unscr_length_addr(9'b001010000)) inst4 (
    .clk(PHY_GTXCLK), .pRST(inst48_out), .cpu_wr_n(cpu_wr_n), .cpu_addr(cpu_addr), .cpu_wdata(cpu_wdata),
    .mac_reset(mac_reset), .packet_size(packt_size), .start_send(start_send), .sdram_channel(sdram_channel),
    .sdram_wr(sdram_wr), .sdram_rd(sdram_rd), .sdram_wraddr_begin(wraddr_begin),
    .sdram_wraddr_end(wraddr_end), .sdram_rdaddr_begin(rdaddr_begin), .sdram_rdaddr_end(rdaddr_end),
    .sdram_pre_clr(sdram_prefifoclr), .sdram_post_clr(sdram_postfifoclr), .source_channel(source_channel),
    .source_framelen(source_framelen), .source_blanklen(source_blanklen),
    .source_start_send(source_start_send), .source_stop_send(source_stop_send),
    .source_totalnum(source_totalnum), .source_cutnum(source_cutnum), .source_headen(source_headen),
    .source_clrfifo(source_clrfifo));  // open: error
  FIFOReadyCheck #(.ready_num(11'b01000000010)) inst92 (
    .clk(PHY_GTXCLK), .reset_n(PHY_RST_N), .fifo_num(fifo_set_usedw), .fifo_ready(ramfifo_ready));
  RdSetFifoCon inst14 (.clk(PHY_GTXCLK), .reset_n(PHY_RST_N), .fifo_num(fifo_set_usedw), .en_out(fifo_set_ack0));
  udp_cmd inst34 (
    .clk(PHY_GTXCLK), .nRST(PHY_RST_N), .cmd_en(cmd_en), .cmd_addr(cmd_addr), .cmd_data(cmd_data),
    .flag(flag), .frame_step(frame_step), .frame_addr_now(frame_addr_now),
    .frame_addr_begin(frame_addr_begin), .frame_addr_end(frame_addr_end));  // open: err
  assign sdram_reset = PHY_RST_N;  // WIRE inst10
  ChannelContant #(.ch_p(8'b00000000)) inst11 (.ch(CH0_wire));
  sdram_ctrl_blk inst66 (
    .CLK_133M(CLK_133M_1), .CLK_125M(PHY_GTXCLK), .nRST(sdram_reset), .channel_contant(CH0_wire),
    .channel_in(sdram_channel), .sdram_wr(sdram_wr), .sdram_rd(sdram_rd), .wraddr_begin(wraddr_begin),
    .wraddr_end(wraddr_end), .rdaddr_begin(rdaddr_begin), .rdaddr_end(rdaddr_end), .ide_data(fifo_set_data),
    .ide_rden(fifo_set_ack0), .fifo_rden(PostFifo_rden), .prefifo_clr(sdram_prefifoclr),
    .postfifo_clr(sdram_postfifoclr), .sdram_wr_done(sdram_wr_done), .PreFifo_wrusedw(PreFifo_wrusedw_sd1),
    .data_sdram(data_sd1), .PostFifoNum_rd_sd(PostFifo_sd1), .SDRAM_CLK(SDRAM_A_CLK),
    .SDRAM_CAS_N(SDRAM_A_CAS_N), .SDRAM_CKE(SDRAM_A_CKE), .SDRAM_CS_N(SDRAM_A_CS_N), .SDRAM_A(SDRAM_A_A),
    .SDRAM_RAS_N(SDRAM_A_RAS_N), .SDRAM_WE_N(SDRAM_A_WE_N), .SDRAM_DQML(SDRAM_A_DQML),
    .SDRAM_DQMH(SDRAM_A_DQMH), .SDRAM_D(SDRAM_A_D));
  SourceChannelBdf inst15 (
    .CLK(PHY_GTXCLK), .CLK_OUT(PHY_GTXCLK), .nRST(PHY_RST_N), .channel_contant(CH0_wire),
    .channel_in(source_channel), .frame_length(source_framelen), .blank_length(source_blanklen),
    .start_send(source_start_send), .stop_send(source_stop_send), .fifo_num_total(source_totalnum),
    .cut_fifo_num(source_cutnum), .head_en(source_headen), .clrfifo(source_clrfifo),
    .post_fifonum(PostFifo_sd1), .data_in(data_sd1), .post_rden(PostFifo_rden), .en_out(en_out),
    .dat_out(dat_out));
  not inst38 (sdram_clr, sdram_reset);

  assign SDRAM_E_CLK = CLK_2;

  // Other names for the same wires on the sheet: CLK_125M = CLK_2; CLK_125M_p = PHY_GTXCLK; CLK_IN_1 = SMA_CLKIN1;
  //   CLK_IN_2 = SMA_CLKIN2; CLK_IN_3 = SMA_CLKIN3; CLK_IN_4 = SMA_CLKIN4; CLK_IN_5 = SMA_CLKIN5;
  //   CLK_IN_6 = SMA_CLKIN6; CLK_IN_7 = SMA_CLKIN7; CLK_IN_8 = SMA_CLKIN8; nRST = PHY_RST_N;
  //   SDRAM_DQM[1:0] = {SDRAM_E_DQMH, SDRAM_E_DQML}; syn_key_pin[7:0] = RECEIVED; XTAL_CLK50M_IN = CLK_1

  // Notes on the sheet:
  //   XX3 信号源—MASTER
  //   时钟管理
  //   CPU
  //   MAC
  //   板载资源
  //   数据接收
  //   复位时灯亮
  //   数据发送
endmodule
